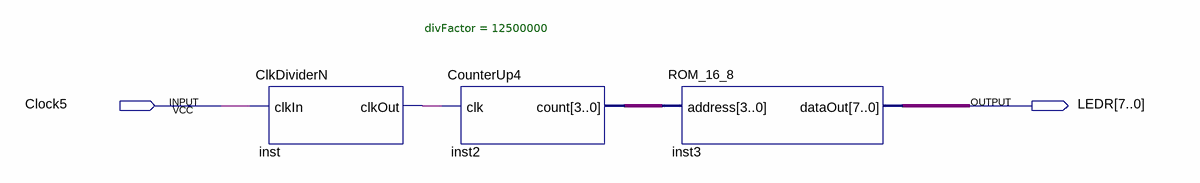
[diagram p0: schematic sheet]
// Quartus schematic ROM_Demo.bdf as structural Verilog: 3 symbols, 2 pins
module ROM_Demo (
  input  Clock5,
  output [7:0] LEDR
);

  wire inst_clkout;
  wire [3:0] inst2_count;

  ClkDividerN #(.divFactor(12500000)) inst (.clkIn(Clock5), .clkOut(inst_clkout));
  CounterUp4 inst2 (.clk(inst_clkout), .count(inst2_count));
  ROM_16_8 inst3 (.address(inst2_count), .dataOut(LEDR));
endmodule
